# EAGLE design convertor_board (EAGLE 7.3.0)
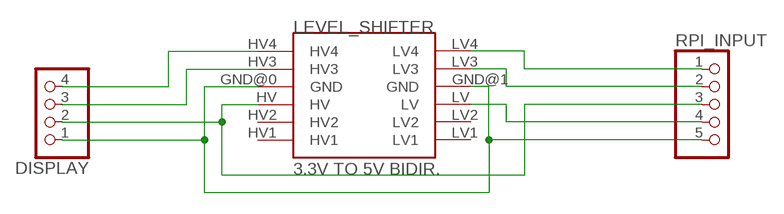
[diagram p0: schematic, sheet 1]

## Parts
DISPLAY  PINHD-1X4  [1X04]
LEVEL_SHIFTER  3.3V TO 5V BIDIR.  LEVEL_SHIFTER  [LEVEL_SHIFTER]
RPI_INPUT  PINHD-1X5  [1X05]

## Nets
N$2: DISPLAY.1 LEVEL_SHIFTER.GND@0(GND) LEVEL_SHIFTER.GND@1(GND) RPI_INPUT.5
N$3: DISPLAY.3 LEVEL_SHIFTER.HV3
N$4: DISPLAY.4 LEVEL_SHIFTER.HV4
N$5: LEVEL_SHIFTER.LV RPI_INPUT.4
N$6: DISPLAY.2 LEVEL_SHIFTER.HV RPI_INPUT.3
N$8: LEVEL_SHIFTER.LV3 RPI_INPUT.2
N$9: LEVEL_SHIFTER.LV4 RPI_INPUT.1
Unconnected: LEVEL_SHIFTER.HV1 LEVEL_SHIFTER.HV2 LEVEL_SHIFTER.LV1 LEVEL_SHIFTER.LV2

## Library data of the parts
DISPLAY = pinhead:PINHD-1X4: PIN HEADER
LEVEL_SHIFTER = level_shifter:LEVEL_SHIFTER: Level shifter 5V <=> 3.3V
RPI_INPUT = pinhead:PINHD-1X5: PIN HEADER

## Board
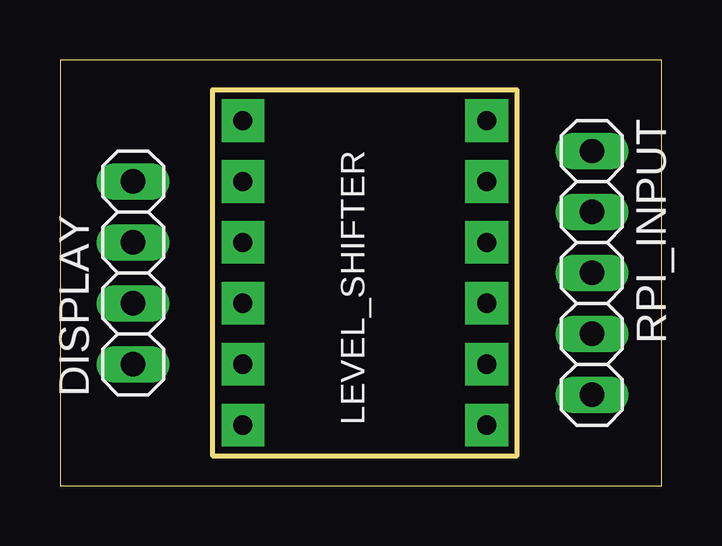
[diagram p1: board, top side]
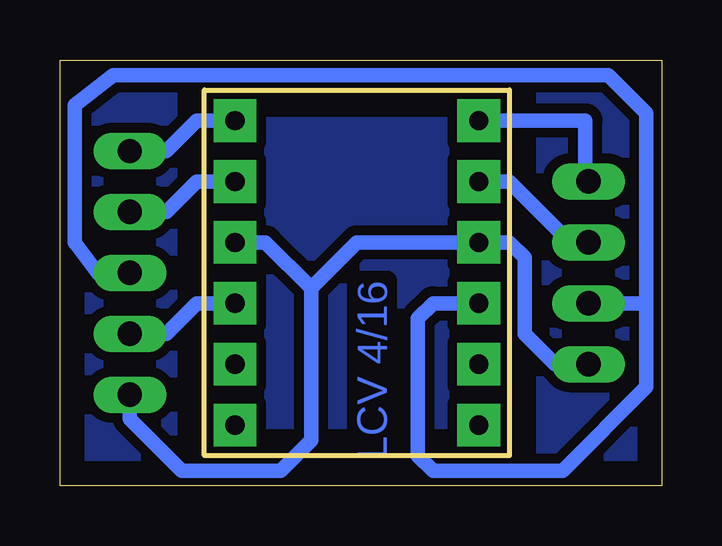
[diagram p2: board, bottom side, seen from below]

Size 25.07 x 17.77 mm. Coordinates in mm from the lower left corner, seen from the top.
Outline: 0,0 25.07,0 25.07,17.77 0,17.77 0,0
Copper layers (1*16): Top 0.035mm / dielectric 1.5mm / Bottom 0.035mm
Design rules "default": minimum track width 10mil, minimum drill 24mil, track to track 8mil, track to pad 8mil, pad to pad 8mil, via to via 8mil, smd to smd 8mil, copper to edge 40mil, drill to drill 8mil, minimum pad ring 10mil, minimum via ring 8mil, stop-mask expansion 4mil, vias tented up to drill 0mil, thermal gap 10mil

### Footprints (pad centres in the part's own frame; a part is rotated, then mirrored left to right if it is on the bottom)
1X04 = drill 1.016 long: 1 -3.81,0; 2 -1.27,0; 3 1.27,0; 4 3.81,0
LEVEL_SHIFTER = drill 0.8 pad 1.778 square: GND@0 -5.08,1.27; GND@1 5.08,1.27; HV -5.08,-1.27; HV1 -5.08,-6.35; HV2 -5.08,-3.81; HV3 -5.08,3.81; HV4 -5.08,6.35; LV 5.08,-1.27; LV1 5.08,-6.35; LV2 5.08,-3.81; LV3 5.08,3.81; LV4 5.08,6.35
1X05 = drill 1.016 long: 1 -5.08,0; 2 -2.54,0; 3 0,0; 4 2.54,0; 5 5.08,0

### Placement (x,y rotation side)
DISPLAY  3.05,8.89 90 top
LEVEL_SHIFTER  12.7,8.89 0 top
RPI_INPUT  22.16,8.89 270 top

### Tracks (layer width: path | path; a pad name or v marks a point on that pad's centre or on a via)
N$1
  pour Bottom (isolate 0.406, rank 2): 0,17.78 0,0 25.08,0 25.08,17.78
N$2
  Bottom 0.61: RPI_INPUT.5 22.16,2.79 20,0.64 15.88,0.64 14.61,1.91 14.61,8.26 | LEVEL_SHIFTER.GND@1 16.51,10.16 14.61,8.26 | DISPLAY.1 4.45,5.08 5.71,6.35 5.71,9.53 6.35,10.16 LEVEL_SHIFTER.GND@0 12.7,10.16 14.61,8.26
N$3
  Bottom 0.61: DISPLAY.3 3.81,10.16 6.35,12.7 LEVEL_SHIFTER.HV3
N$4
  Bottom 0.406: DISPLAY.4 3.17,12.7
  Bottom 0.61: 3.17,12.7 3.17,15.24 LEVEL_SHIFTER.HV4
N$5
  Bottom 0.61: RPI_INPUT.4 20.64,6.35 19.37,7.62 LEVEL_SHIFTER.LV
N$6
  Bottom 0.406: RPI_INPUT.3 23.5,8.89
  Bottom 0.61: DISPLAY.2 0.64,7.62 | 0.64,7.62 0.64,4.13 4.13,0.64 9.53,0.64 10.16,1.27 10.16,6.99 9.53,7.62 LEVEL_SHIFTER.HV | 23.5,8.89 24.45,10.16 24.45,15.88 22.86,17.14 2.22,17.14 0.64,15.56 0.64,7.62
N$8
  Bottom 0.61: RPI_INPUT.2 20.64,11.43 19.37,12.7 LEVEL_SHIFTER.LV3
N$9
  Bottom 0.61: RPI_INPUT.1 20.64,13.97 19.37,15.24 LEVEL_SHIFTER.LV4

### Text on the board
Bottom: LCV 4/16
tDocu: SCL | SCL | SDA | SDA | 5V | 5V | 3.3V | GND | GND